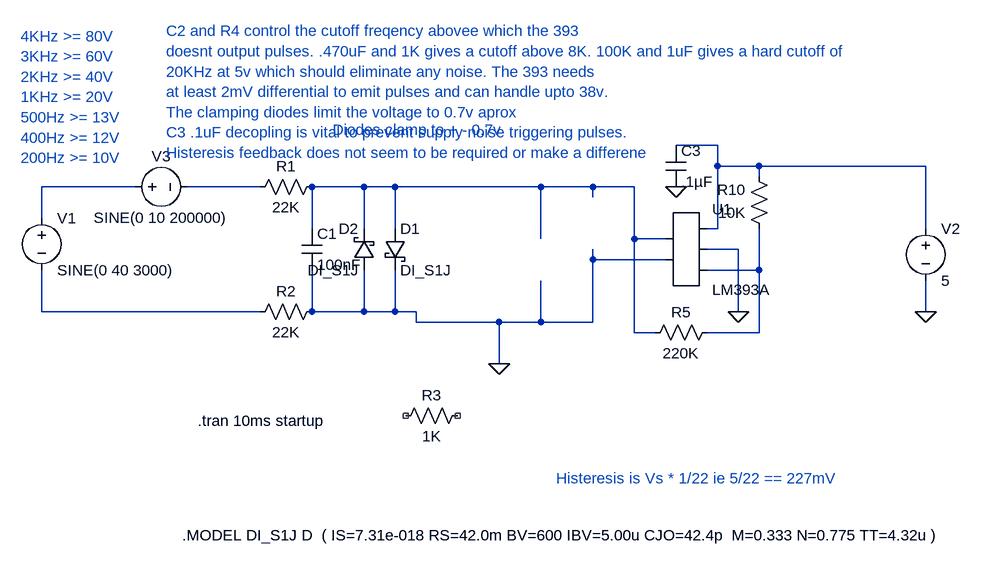
[diagram p0: schematic FlyWheelPickup.asc]
FlyWheelPickup.asc, the LTspice schematic file:
Version 4
SHEET 1 1636 808
WIRE 688 192 624 192
WIRE 688 224 688 192
WIRE 752 224 688 224
WIRE 1008 224 752 224
WIRE 752 240 752 224
WIRE -208 256 -352 256
WIRE -16 256 -128 256
WIRE 144 256 64 256
WIRE 192 256 144 256
WIRE 416 256 192 256
WIRE 496 256 416 256
WIRE 560 256 496 256
WIRE 496 272 496 256
WIRE -352 304 -352 256
WIRE 64 320 64 256
WIRE 144 320 144 256
WIRE 192 320 192 256
WIRE 688 320 688 224
WIRE 688 320 672 320
WIRE 1008 320 1008 224
WIRE 416 336 416 256
WIRE 560 336 560 256
WIRE 608 336 560 336
WIRE 720 352 672 352
WIRE 496 368 496 352
WIRE 608 368 496 368
WIRE 752 384 752 320
WIRE 752 384 672 384
WIRE -352 448 -352 384
WIRE -16 448 -352 448
WIRE 64 448 64 384
WIRE 144 448 144 384
WIRE 144 448 64 448
WIRE 192 448 192 384
WIRE 192 448 144 448
WIRE 224 448 192 448
WIRE 720 448 720 352
WIRE 1008 448 1008 400
WIRE 224 464 224 448
WIRE 352 464 224 464
WIRE 416 464 416 400
WIRE 416 464 352 464
WIRE 496 464 496 368
WIRE 496 464 416 464
WIRE 560 480 560 336
WIRE 592 480 560 480
WIRE 752 480 752 384
WIRE 752 480 672 480
WIRE 352 528 352 464
FLAG 1008 448 0
FLAG 720 448 0
FLAG 352 528 0
FLAG 624 256 0
SYMBOL voltage -352 288 R0
SYMATTR InstName V1
SYMATTR Value SINE(0 40 3000)
SYMBOL res 80 240 R90
WINDOW 0 0 56 VBottom 2
WINDOW 3 32 56 VTop 2
SYMATTR InstName R1
SYMATTR Value 22K
SYMBOL res 80 432 R90
WINDOW 0 0 56 VBottom 2
WINDOW 3 32 56 VTop 2
SYMATTR InstName R2
SYMATTR Value 22K
SYMBOL voltage 1008 304 R0
SYMATTR InstName V2
SYMATTR Value 5
SYMATTR SpiceLine Rser=10
SYMBOL schottky 176 320 R0
SYMATTR InstName D1
SYMATTR Value DI_S1J
SYMATTR Description Diode
SYMATTR Type diode
SYMBOL schottky 160 384 R180
WINDOW 0 24 64 Left 2
WINDOW 3 24 0 Left 2
SYMATTR InstName D2
SYMATTR Value DI_S1J
SYMATTR Description Diode
SYMATTR Type diode
SYMBOL AutoGenerated/LM393A 640 352 R0
SYMATTR InstName U1
SYMBOL Res 768 336 R180
WINDOW 0 36 76 Left 2
WINDOW 3 36 40 Left 2
SYMATTR InstName R10
SYMATTR Value 10K
SYMBOL cap 608 192 R0
SYMATTR InstName C3
SYMATTR Value .1µF
SYMBOL res 688 464 R90
WINDOW 0 0 56 VBottom 2
WINDOW 3 32 56 VTop 2
SYMATTR InstName R5
SYMATTR Value 220K
SYMBOL voltage -224 256 R270
WINDOW 0 32 56 VTop 2
WINDOW 3 -32 56 VBottom 2
SYMATTR InstName V3
SYMATTR Value SINE(0 10 200000)
SYMBOL Cap 48 320 R0
SYMATTR InstName C1
SYMATTR Value 100nF
SYMBOL Res 304 592 R90
WINDOW 0 0 56 VBottom 2
WINDOW 3 32 56 VTop 2
SYMATTR InstName R3
SYMATTR Value 1K
TEXT -112 616 Left 2 !.tran 10ms startup
TEXT -384 24 Left 2 ;4KHz >= 80V\n3KHz >= 60V\n2KHz >= 40V\n1KHz >= 20V\n500Hz >= 13V\n400Hz >= 12V\n200Hz >= 10V
TEXT 96 168 Left 2 ;Diodes clamp to + - 0.7v
TEXT 440 704 Left 2 ;Histeresis is Vs * 1/22 ie 5/22 == 227mV
TEXT -136 792 Left 2 !.MODEL DI_S1J D  ( IS=7.31e-018 RS=42.0m BV=600 IBV=5.00u CJO=42.4p  M=0.333 N=0.775 TT=4.32u )
TEXT -160 16 Left 2 ;C2 and R4 control the cutoff freqency abovee which the 393 \ndoesnt output pulses. .470uF and 1K gives a cutoff above 8K. 100K and 1uF gives a hard cutoff of \n20KHz at 5v which should eliminate any noise. The 393 needs\nat least 2mV differential to emit pulses and can handle upto 38v. \nThe clamping diodes limit the voltage to 0.7v aprox\nC3 .1uF decopling is vital to prevent supply noise triggering pulses.\nHisteresis feedback does not seem to be required or make a differene

The netlist it stands for:
* FlyWheelPickup.asc
V1 N002 N006 SINE(0 40 3000)
R1 N004 N003 22K
R2 0 N006 22K
V2 N001 0 5 Rser=10
D1 N004 0 DI_S1J
D2 0 N004 DI_S1J
* U1: LM393A (symbol AutoGenerated/LM393A not available, pins judged from their places): pin1=N004 pin2=0 pin3=N001 pin4=0 pin5=N005
R10 N005 N001 10K
C3 N001 0 .1µF
R5 N005 N004 220K
V3 N002 N003 SINE(0 10 200000)
C1 N004 0 100nF
R3 NC_01 NC_02 1K
.model D D
.lib standard.dio
.tran 10ms startup
* 4KHz >= 80V
* 3KHz >= 60V
* 2KHz >= 40V
* 1KHz >= 20V
* 500Hz >= 13V
* 400Hz >= 12V
* 200Hz >= 10V
* Diodes clamp to + - 0.7v
* Histeresis is Vs * 1/22 ie 5/22 == 227mV
.MODEL DI_S1J D  ( IS=7.31e-018 RS=42.0m BV=600 IBV=5.00u CJO=42.4p  M=0.333 N=0.775 TT=4.32u )
* C2 and R4 control the cutoff freqency abovee which the 393
* doesnt output pulses. .470uF and 1K gives a cutoff above 8K. 100K and 1uF gives a hard cutoff of
* 20KHz at 5v which should eliminate any noise. The 393 needs
* at least 2mV differential to emit pulses and can handle upto 38v.
* The clamping diodes limit the voltage to 0.7v aprox
* C3 .1uF decopling is vital to prevent supply noise triggering pulses.
* Histeresis feedback does not seem to be required or make a differene
.backanno
.end